# Altium schematic sheet TopSheet.SchDoc
size A4
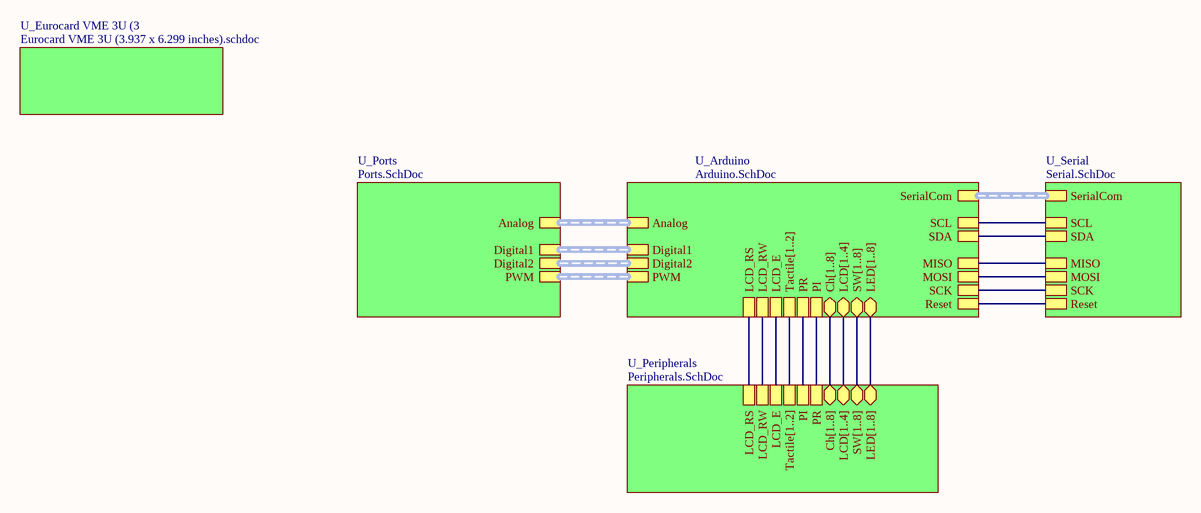
[diagram p0: TopSheet.SchDoc]

## Sub-sheets
U_Arduino = Arduino.SchDoc: SerialCom (harness SerialMC), LED[1..8] (bidir), SW[1..8] (bidir), LCD[1..4] (bidir), PR, PI, Ch[1..8] (bidir), Reset, SCK, MISO, MOSI, Tactile[1..2], Digital1 (harness Digital1), Digital2 (harness Digital2), PWM (harness PWM), Analog (harness Analog1), SCL, SDA, LCD_E, LCD_RW, LCD_RS
U_Eurocard VME 3U (3 = Eurocard VME 3U (3.937 x 6.299 inches).schdoc: no entries
U_Peripherals = Peripherals.SchDoc: LED[1..8] (bidir), SW[1..8] (bidir), LCD[1..4] (bidir), PI, PR, Ch[1..8] (bidir), Tactile[1..2], LCD_E, LCD_RW, LCD_RS
U_Ports = Ports.SchDoc: PWM, Digital1, Digital2, Analog (harness Analog1Port)
U_Serial = Serial.SchDoc: SerialCom (harness Serial3), MISO, Reset, SCK, MOSI, SCL, SDA

## Nets
(unnamed): sheet U_Arduino/PR, sheet U_Peripherals/PI
(unnamed): sheet U_Arduino/PI, sheet U_Peripherals/PR
(unnamed): sheet U_Arduino/Reset, sheet U_Serial/Reset
(unnamed): sheet U_Arduino/SCK, sheet U_Serial/SCK
(unnamed): sheet U_Arduino/MISO, sheet U_Serial/MISO
(unnamed): sheet U_Arduino/MOSI, sheet U_Serial/MOSI
(unnamed): sheet U_Arduino/SCL, sheet U_Serial/SCL
(unnamed): sheet U_Arduino/SDA, sheet U_Serial/SDA
(unnamed): sheet U_Arduino/LCD_E, sheet U_Peripherals/LCD_E
(unnamed): sheet U_Arduino/LCD_RW, sheet U_Peripherals/LCD_RW
(unnamed): sheet U_Arduino/LCD_RS, sheet U_Peripherals/LCD_RS

## Buses and harness runs
bus sheet U_Arduino/Ch[1..8] = sheet U_Peripherals/Ch[1..8]
bus sheet U_Arduino/LCD[1..4] = sheet U_Peripherals/LCD[1..4]
bus sheet U_Arduino/LED[1..8] = sheet U_Peripherals/LED[1..8]
bus sheet U_Arduino/SW[1..8] = sheet U_Peripherals/SW[1..8]
bus sheet U_Arduino/Tactile[1..2] = sheet U_Peripherals/Tactile[1..2]
harness sheet U_Arduino/Analog = sheet U_Ports/Analog
harness sheet U_Arduino/Digital1 = sheet U_Ports/Digital1
harness sheet U_Arduino/Digital2 = sheet U_Ports/Digital2
harness sheet U_Arduino/PWM = sheet U_Ports/PWM
harness sheet U_Arduino/SerialCom = sheet U_Serial/SerialCom